# EAGLE design MacroRail (EAGLE 9.5.1)
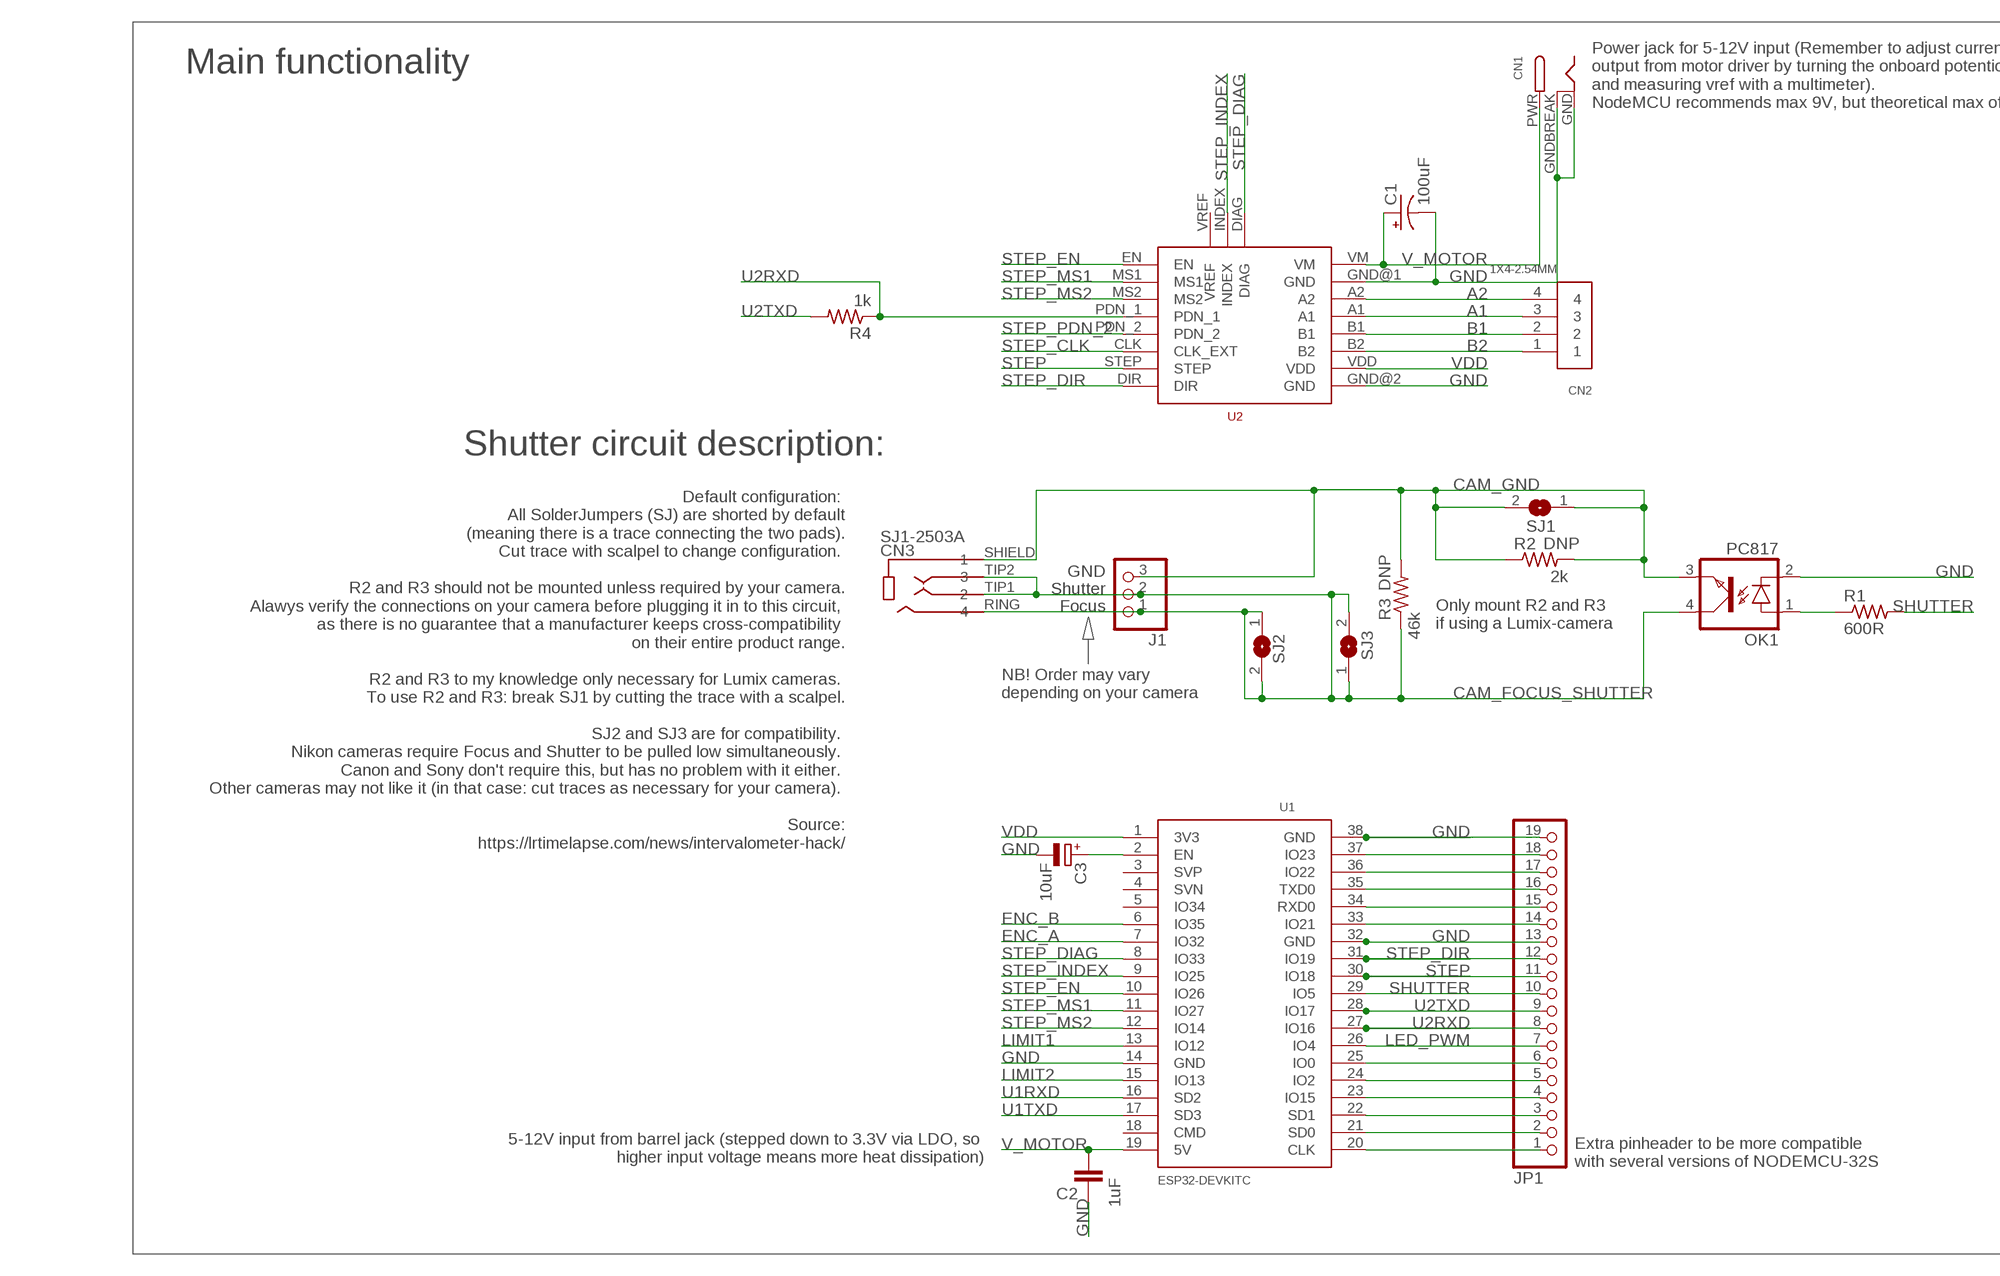
[diagram p0: schematic, sheet 1, part 1 of 2]
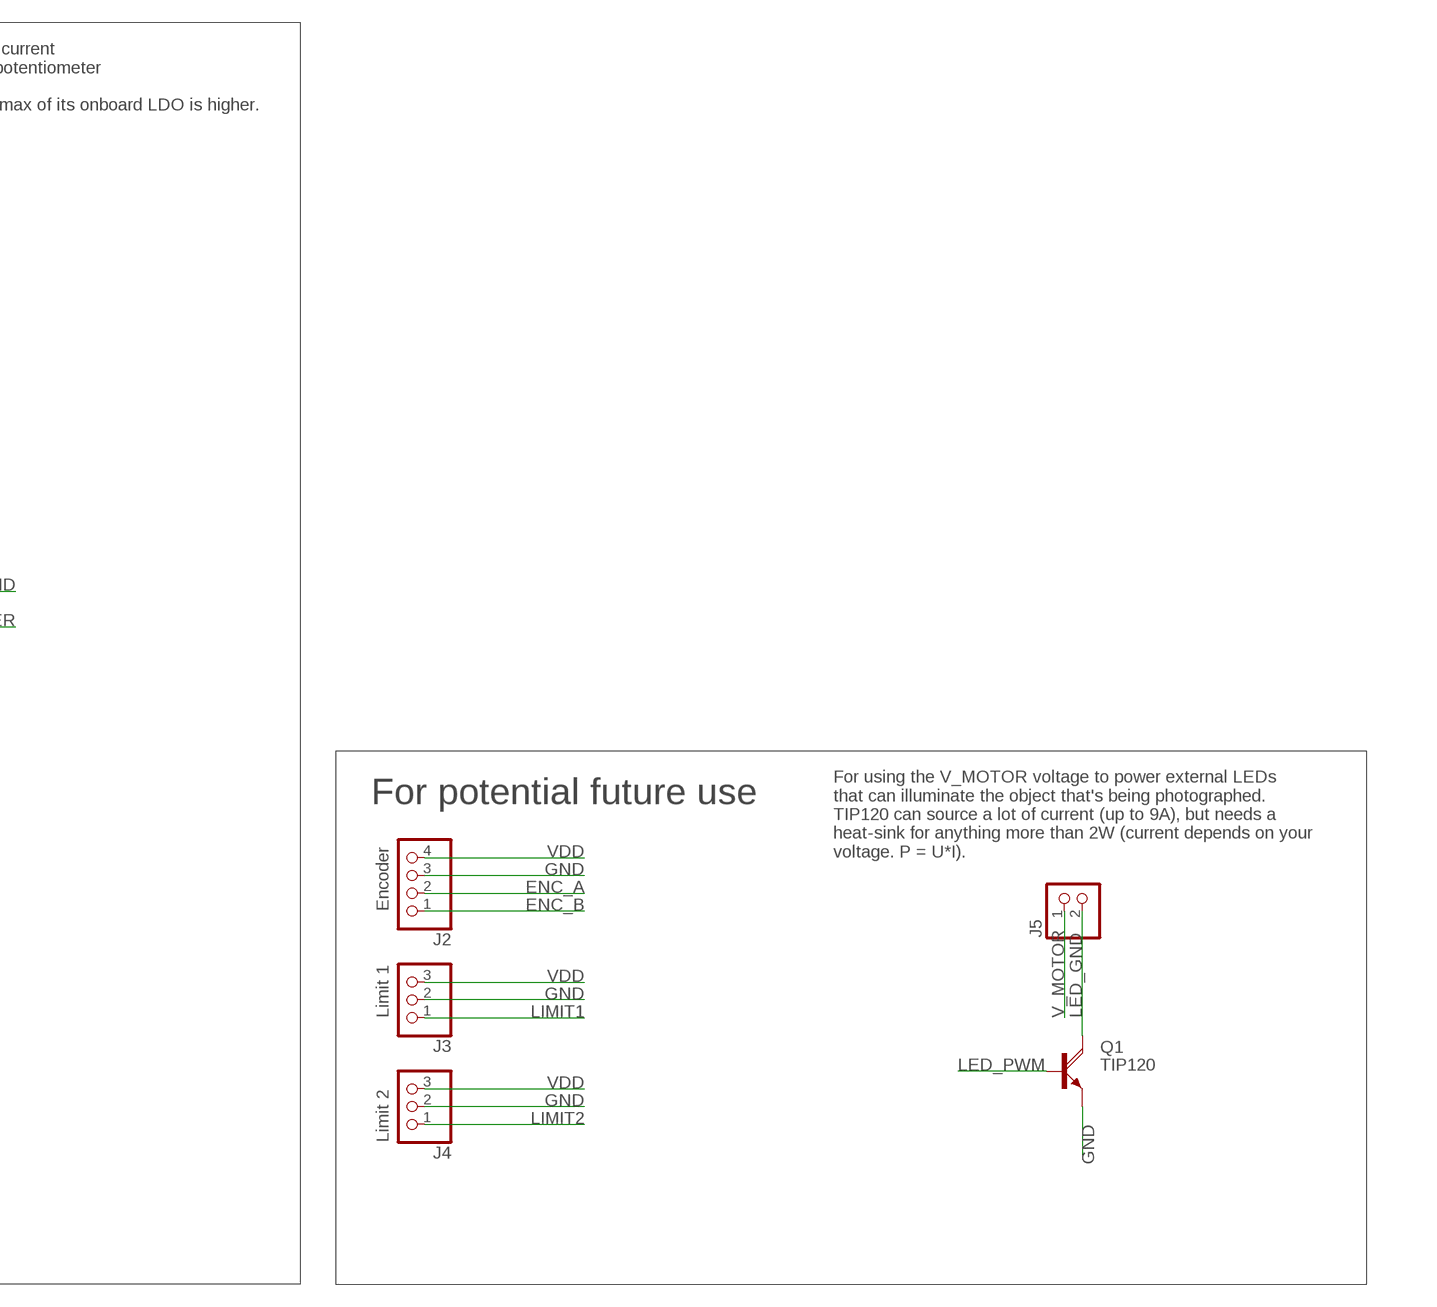
[diagram p1: schematic, sheet 1, part 2 of 2]

## Parts
C1  100uF  CPOL-USE5-8.5  [E5-8,5]
C2  1uF  C-EU050-024X044  [C050-024X044]
C3  10uF  CPOL-EUE1.8-4  [E1,8-4]
CN1  DCBARRELPTH  [DCJACK_2MM_PTH]
CN2  1X4-2.54MM  [1X04-2.54MM]
CN3  SJ1-2503A  [STEREOJACK2.5MM_STEREOJACK2.5MM]
J1  PINHD-1X3CB  [1X03-CLEANBIG]
J2  PINHD-1X4  [1X04]
J3  PINHD-1X3CB  [1X03-CLEANBIG]
J4  PINHD-1X3CB  [1X03-CLEANBIG]
J5  PINHD-1X2CLEAN  [1X02CLEAN]
JP1  PINHD-1X19  [1X19]
OK1  PC817  [DIL04]
Q1  TIP120  [TO220AH]
R1  600R  R-US_0207/7  [0207/7]
R2  2k  R-US_0207/7  [0207/7]
R3  46k  R-US_0207/7  [0207/7]
R4  1k  R-US_0207/7  [0207/7]
SJ1  SJ  [SJ]
SJ2  SJ  [SJ]
SJ3  SJ  [SJ]
U1  ESP32DEVKITCWIDE  [NODEMCU-32S]
U2  TMC2209-V1.2+INDEX  [BIGTREETECH-TMC2209-V1.2+INDEX]

## Nets
A1 [PWR]: CN2.3 U2.A1
A2 [PWR]: CN2.4 U2.A2
B1 [PWR]: CN2.2 U2.B1
B2 [PWR]: CN2.1 U2.B2
CAM_FOCUS_SHUTTER: CN3.RING CN3.TIP1 CN3.TIP2 J1.1 J1.2 OK1.4(COL) R3.1 SJ2.1 SJ2.2 SJ3.1 SJ3.2
CAM_GND: CN3.SHIELD J1.3 OK1.3(EMIT) R2.1 R2.2 R3.2 SJ1.1 SJ1.2
ENC_A: J2.2 U1.7(IO32)
ENC_B: J2.1 U1.6(IO35)
GND [PWR]: C1.- C2.1 C3.- CN1.GND CN1.GNDBREAK J2.3 J3.2 J4.2 JP1.13 JP1.19 OK1.2(C) Q1.E U1.14(GND) U1.32(GND) U1.38(GND) U2.GND@1(GND) U2.GND@2(GND)
LED_GND: J5.2 Q1.C
LED_PWM: JP1.7 Q1.B U1.26(IO4)
LIMIT1: J3.1 U1.13(IO12)
LIMIT2: J4.1 U1.15(IO13)
N$1: OK1.1(A) R1.1
N$2: C3.+ U1.2(EN)
N$3: JP1.18 U1.37(IO23)
N$4: JP1.17 U1.36(IO22)
N$5: JP1.16 U1.35(TXD0)
N$6: JP1.15 U1.34(RXD0)
N$7: JP1.14 U1.33(IO21)
N$10: JP1.6 U1.25(IO0)
N$11: JP1.5 U1.24(IO2)
N$12: JP1.4 U1.23(IO15)
N$13: JP1.3 U1.22(SD1)
N$14: JP1.2 U1.21(SD0)
N$15: JP1.1 U1.20(CLK)
SHUTTER: JP1.10 R1.2 U1.29(IO5)
STEP: JP1.11 U1.30(IO18) U2.STEP
STEP_CLK [PWR]: U2.CLK(CLK_EXT)
STEP_DIAG: U1.8(IO33) U2.DIAG
STEP_DIR: JP1.12 U1.31(IO19) U2.DIR
STEP_EN: U1.10(IO26) U2.EN
STEP_INDEX: U1.9(IO25) U2.INDEX
STEP_MS1: U1.11(IO27) U2.MS1
STEP_MS2: U1.12(IO14) U2.MS2
STEP_PDN_2: U2.PDN_2
U1RXD: U1.16(SD2)
U1TXD: U1.17(SD3)
U2RXD: JP1.8 R4.1 U1.27(IO16) U2.PDN_1
U2TXD: JP1.9 R4.2 U1.28(IO17)
V_MOTOR [PWR]: C1.+ C2.2 CN1.PWR J5.1 U1.19(5V) U2.VM
VDD [PWR]: J2.4 J3.3 J4.3 U1.1(3V3) U2.VDD
Unconnected: U1.3(SVP) U1.4(SVN) U1.5(IO34) U1.18(CMD) U2.VREF

## Notes on the sheet
- Main functionality
- Power jack for 5-12V input (Remember to adjust current 
  output from motor driver by turning the onboard potentiometer
  and measuring vref with a multimeter).
  NodeMCU recommends max 9V, but theoretical max of its onboard LDO is higher.
- Shutter circuit description:
- Default configuration: 
  All SolderJumpers (SJ) are shorted by default
  (meaning there is a trace connecting the two pads).
  Cut trace with scalpel to change configuration. 
  
  R2 and R3 should not be mounted unless required by your camera.
  Alawys verify the connections on your camera before plugging it in to this circuit, 
  as there is no guarantee that a manufacturer keeps cross-compatibility 
  on their entire product range.
  
  R2 and R3 to my knowledge only necessary for Lumix cameras. 
  To use R2 and R3: break SJ1 by cutting the trace with a scalpel.
  
  SJ2 and SJ3 are for compatibility. 
  Nikon cameras require Focus and Shutter to be pulled low simultaneously. 
  Canon and Sony don't require this, but has no problem with it either. 
  Other cameras may not like it (in that case: cut traces as necessary for your camera). 
  
  Source:
  https://lrtimelapse.com/news/intervalometer-hack/
- GND
- Shutter
- Focus
- Only mount R2 and R3 
  if using a Lumix-camera
- NB! Order may vary 
  depending on your camera
- For potential future use
- For using the V_MOTOR voltage to power external LEDs 
  that can illuminate the object that's being photographed.
  TIP120 can source a lot of current (up to 9A), but needs a 
  heat-sink for anything more than 2W (current depends on your
  voltage. P = U*I).
- Encoder
- Limit 1
- Limit 2
- 5-12V input from barrel jack (stepped down to 3.3V via LDO, so 
  higher input voltage means more heat dissipation)
- Extra pinheader to be more compatible 
  with several versions of NODEMCU-32S

## Library data of the parts
C1 = rcl:CPOL-US: POLARIZED CAPACITOR, American symbol; SPICEPREFIX: C
C2 = rcl:C-EU: CAPACITOR, European symbol; SPICEPREFIX: C
C3 = rcl:CPOL-EU: POLARIZED CAPACITOR, European symbol; SPICEPREFIX: C
CN1 = 00-Random-Components-Simen:DCBARREL: 2.0mm DC Barrel Jack DCJACK_2MM_PTH - Through Hole Jack (4UConnector: 05537)
CN2 = 00-Random-Components-Simen:1X4: 4-pin connector
CN3 = 00-Random-Components-Simen:SJ1-2503A: Stereo jack 2.5mm Mouser:https://no.mouser.com/ProductDetail/CUI-Devices/SJ1-2503A?qs=WyjlAZoYn52728cbIH3aBA%3D%3D Mechanical drawing: https://no.mouser.com/datasheet/2/670/sj1_2503a-1779217.pdf AliExpress: https://s.click.aliexpress.com/e/_AMfutT
J1 J3 J4 = adafruit:PINHD-1X3: PIN HEADER
J2 = pinhead-custom:PINHD-1X4: PIN HEADER
J5 = pinhead-custom:PINHD-1X2: PIN HEADER
JP1 = pinhead-custom:PINHD-1X19: PIN HEADER
OK1 = 00-Random-Components-Simen:PC817: SHARP OPTO COUPLER; MPN: PC817X4J000F; OC_FARNELL: 9707727; OC_NEWARK: 97K7059
Q1 = 00-Random-Components-Simen:TIP120: NPN DARLINGTON TRANSISTOR
R1 R4 = rcl:R-US_: RESISTOR, American symbol; SPICEPREFIX: R
R2 R3 = rcl:R-US_: RESISTOR, American symbol; DNP: 1; SPICEPREFIX: R
SJ1-SJ3 = jumper:SJ: SMD solder JUMPER
U1 = ESP32-DEVKITC:ESP32DEVKITC: Documentation: https://docs.ai-thinker.com/en/esp32/boards/nodemcu_32s
U2 = 00-Random-Components-Simen:TMC2209-V1.2+INDEX: Manual: https://github.com/bigtreetech/BIGTREETECH-TMC2209-V1.2/blob/master/manual/TMC2209-V1.2-manual.pdf https://www.aliexpress.com/item/1005002625638207.html

## Net classes
1 PWR: width 1.27 mm

## Board
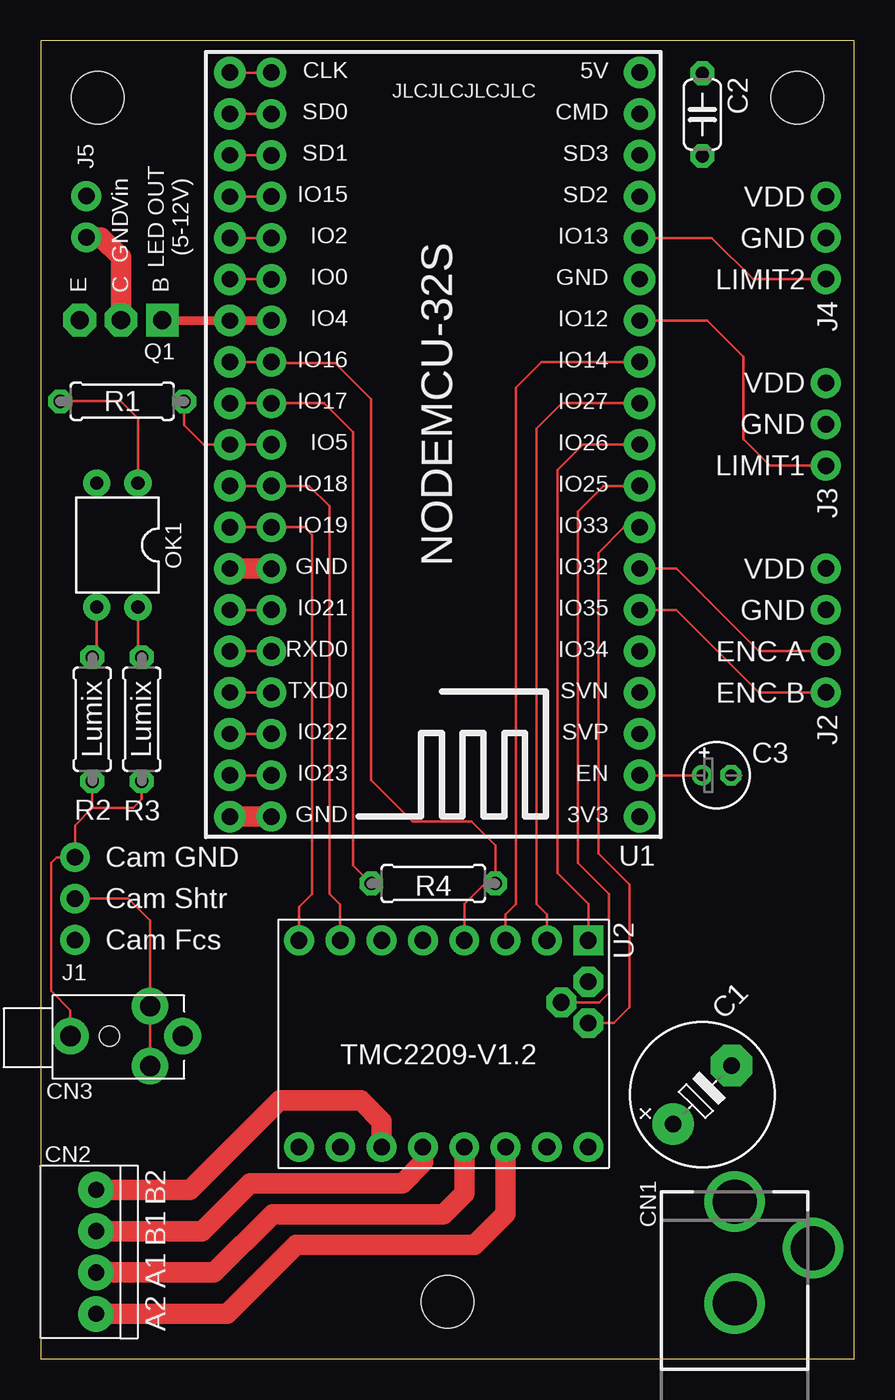
[diagram p2: board, top side]
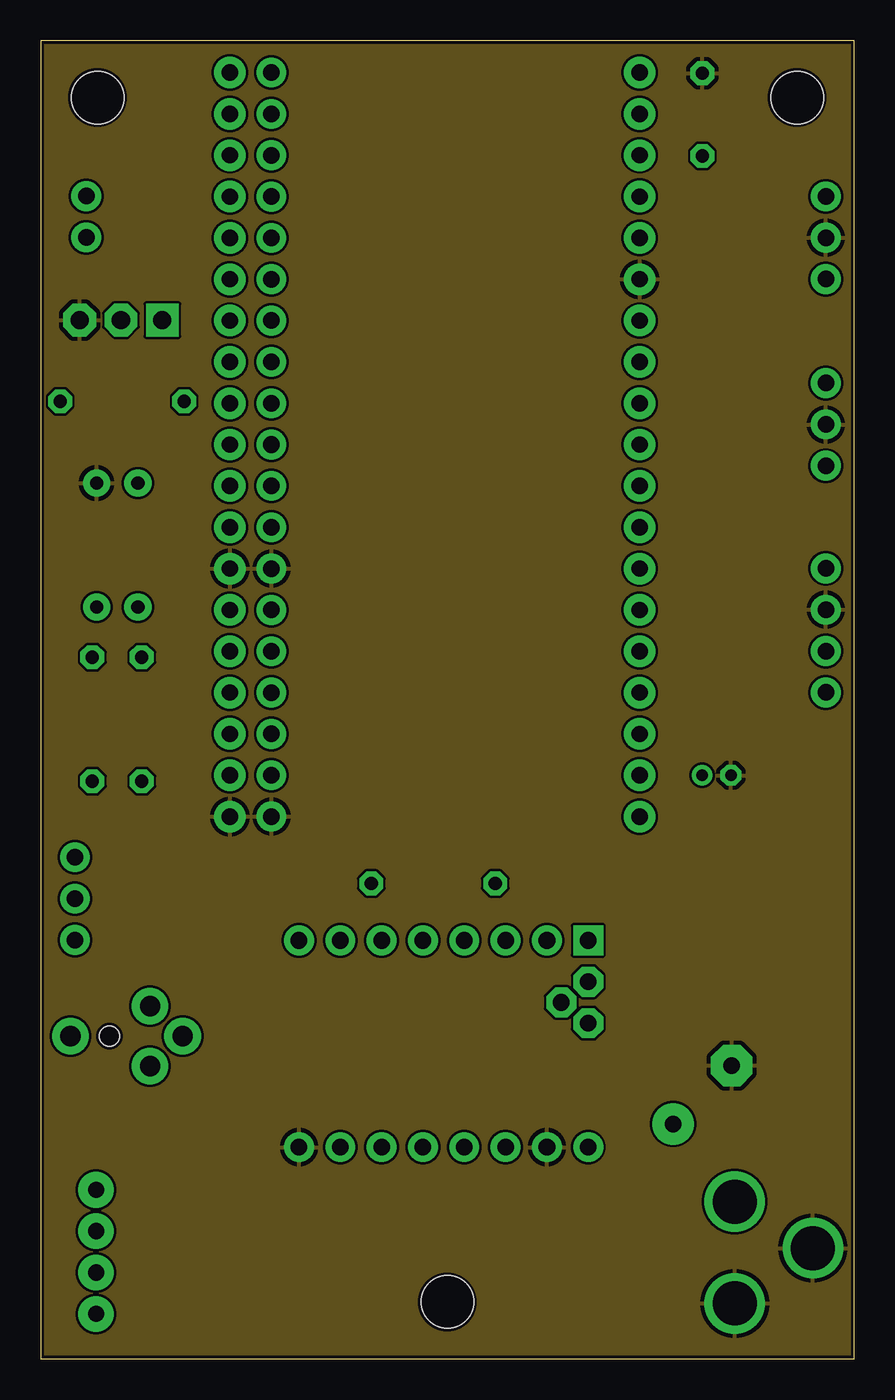
[diagram p3: board, inner layer Route2]
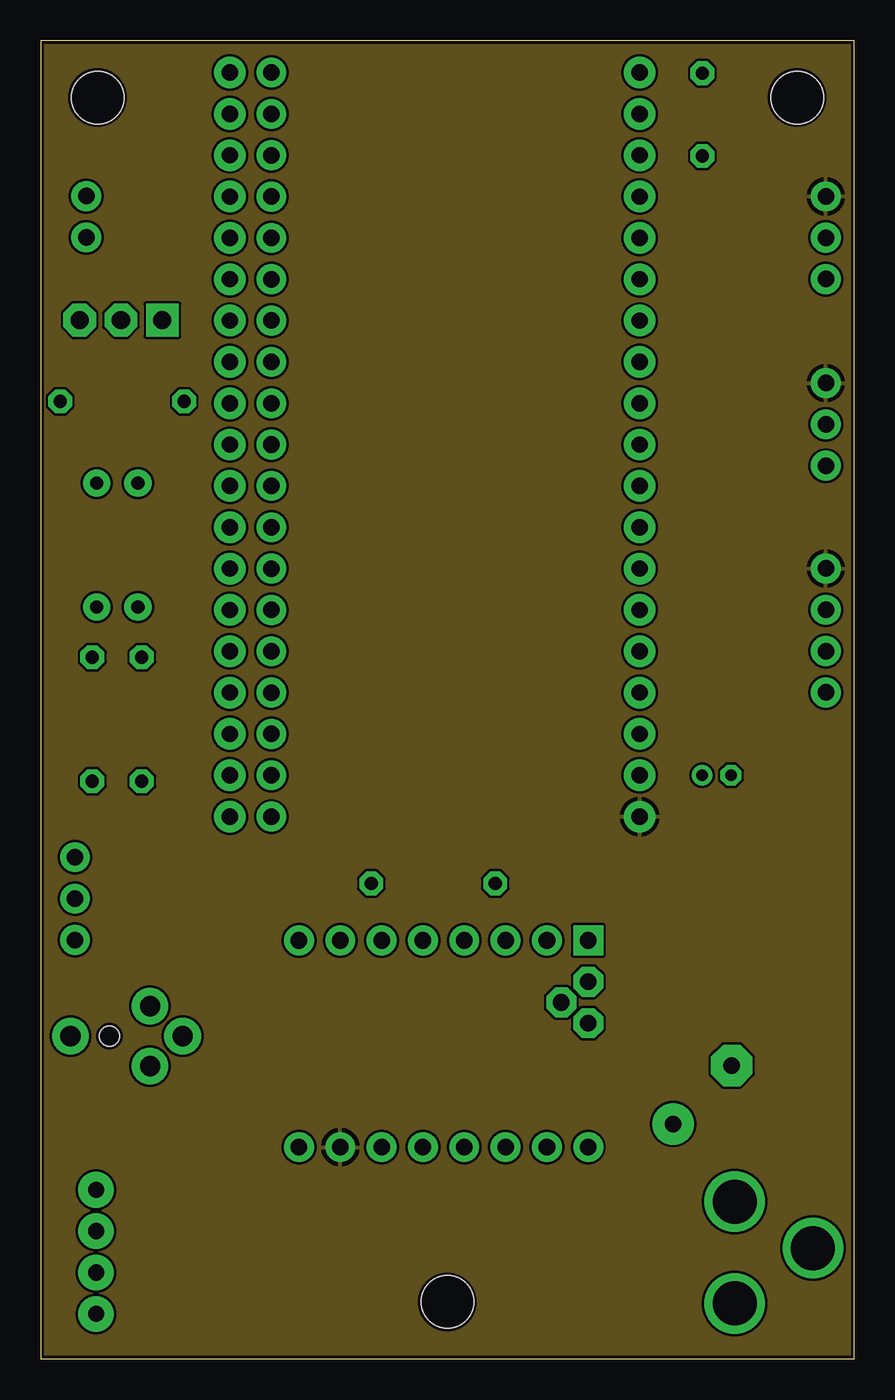
[diagram p4: board, inner layer Route15]
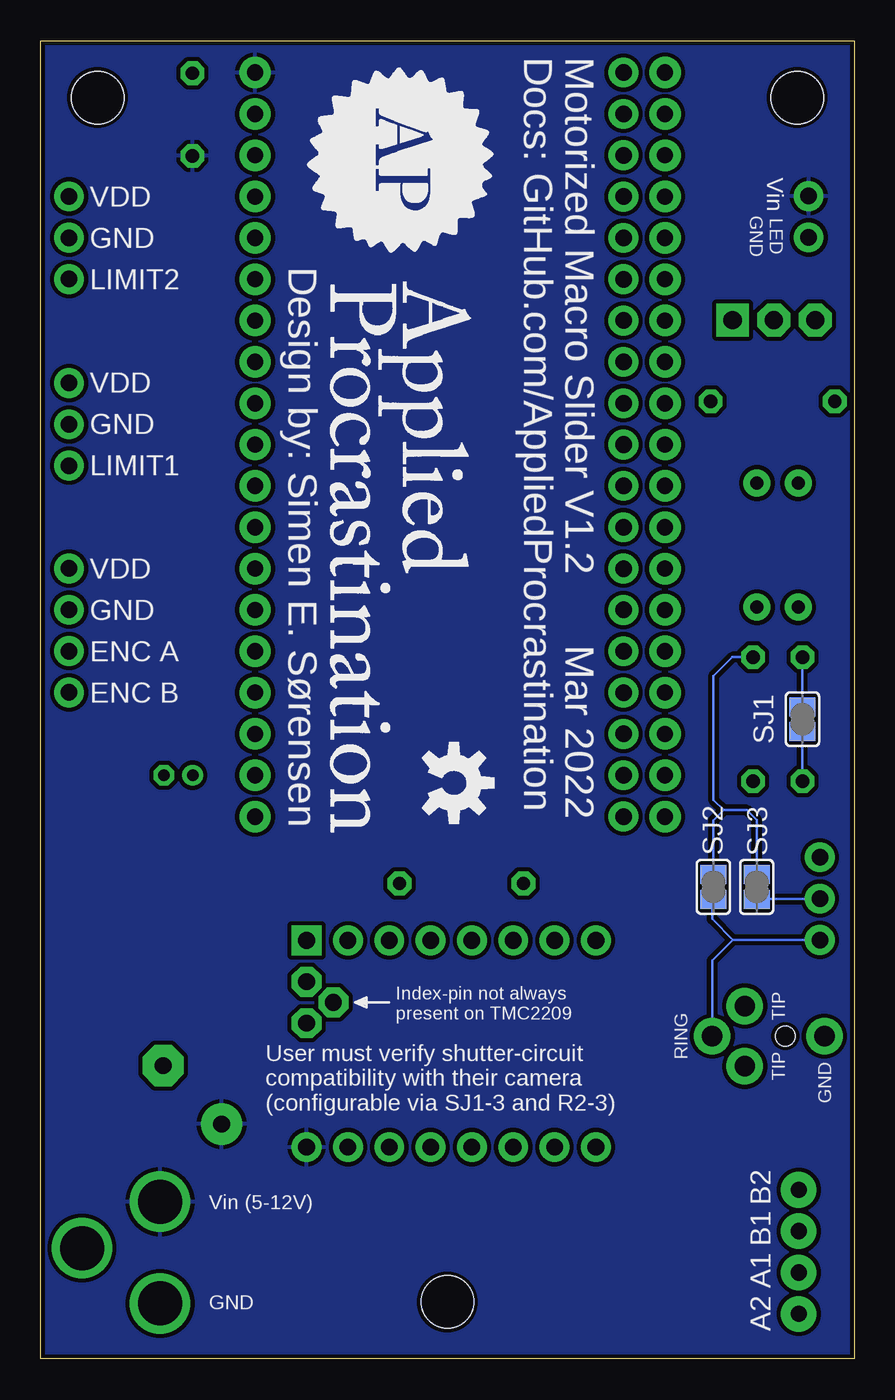
[diagram p5: board, bottom side, seen from below]

Size 50 x 81 mm. Coordinates in mm from the lower left corner, seen from the top.
Outline: 0,0 50,0 50,81 0,81 0,0
Copper layers (1*16): Top 0.035mm / dielectric 1.5mm / Bottom 0.035mm
Design rules "default *": minimum track width 6mil, minimum drill 0.35mm, track to track 6mil, track to pad 6mil, pad to pad 6mil, via to via 6mil, smd to smd 6mil, copper to edge 0.2mm, drill to drill 6mil, minimum pad ring 10mil, minimum via ring 8mil, stop-mask expansion 4mil, vias tented up to drill 0mil, thermal gap 10mil
Holes 3.2 mm at 46.5,77.5 3.5,77.5 25,3.5

### Footprints (pad centres in the part's own frame; a part is rotated, then mirrored left to right if it is on the bottom)
E5-8,5 = drill 1.016 pad 2.54: + -2.54,0 | drill 1.016 pad 2.54 octagon: - 2.54,0
C050-024X044 = drill 0.813 octagon: 1 -2.54,0; 2 2.54,0
E1,8-4 = drill 0.711 pad 1.168: + -0.889,0 | drill 0.711 pad 1.168 octagon: - 0.889,0
DCJACK_2MM_PTH = drill 2.7: GND 0,7.35; GNDBREAK 4.8,10.75; PWR 0,13.6
1X04-2.54MM = drill 1 pad 2.184: 1 -3.81,0; 2 -1.27,0; 3 1.27,0; 4 3.81,0
STEREOJACK2.5MM_STEREOJACK2.5MM = drill 1.25: RING 4.5,0; SHIELD -2.4,0; TIP1 2.5,-1.85; TIP2 2.5,1.85 | hole 1.2: 0,0
1X03-CLEANBIG = drill 1.016 pad 1.676: 1 -2.54,0; 2 0,0; 3 2.54,0
1X04 = drill 1.016: 1 -3.81,0; 2 -1.27,0; 3 1.27,0; 4 3.81,0
1X02CLEAN = drill 1.016: 1 -1.27,0; 2 1.27,0
1X19 = drill 1.016: 1 -22.86,0; 2 -20.32,0; 3 -17.78,0; 4 -15.24,0; 5 -12.7,0; 6 -10.16,0; 7 -7.62,0; 8 -5.08,0; 9 -2.54,0; 10 0,0; 11 2.54,0; 12 5.08,0; 13 7.62,0; 14 10.16,0; 15 12.7,0; 16 15.24,0; 17 17.78,0; 18 20.32,0; 19 22.86,0
DIL04 = drill 0.813 pad 1.676: 1 -1.27,-3.81; 2 1.27,-3.81; 3 1.27,3.81; 4 -1.27,3.81
TO220AH = drill 1.118 pad 1.778 square: B 0,0 | drill 1.118 pad 1.778 octagon: C 2.54,0; E 5.08,0
0207/7 = drill 0.813 octagon: 1 -3.81,0; 2 3.81,0
SJ = smd 1.168 x 1.6: 1 -0.762,0; 2 0.762,0
NODEMCU-32S = drill 1 pad 1.93: 1 -22.87,-11.42; 2 -20.33,-11.42; 3 -17.79,-11.42; 4 -15.25,-11.42; 5 -12.71,-11.42; 6 -10.17,-11.42; 7 -7.63,-11.42; 8 -5.09,-11.42; 9 -2.55,-11.42; 10 -0.01,-11.42; 11 2.53,-11.42; 12 5.07,-11.42; 13 7.61,-11.42; 14 10.15,-11.42; 15 12.69,-11.42; 16 15.23,-11.42; 17 17.77,-11.42; 18 20.31,-11.42; 19 22.85,-11.42; 20 22.85,13.77; 21 20.31,13.77; 22 17.77,13.77; 23 15.23,13.77; 24 12.69,13.77; 25 10.15,13.77; 26 7.61,13.77; 27 5.07,13.77; 28 2.53,13.77; 29 -0.01,13.77; 30 -2.55,13.77; 31 -5.09,13.77; 32 -7.63,13.77; 33 -10.17,13.77; 34 -12.71,13.77; 35 -15.25,13.77; 36 -17.79,13.77; 37 -20.33,13.77; 38 -22.87,13.77
BIGTREETECH-TMC2209-V1.2+INDEX = drill 1.02: A1 12.7,-7.62; A2 12.7,-5.08; B1 12.7,-10.16; B2 12.7,-12.7; CLK 0,-12.7; DIR 0,-17.78; GND@1 12.7,-17.78; GND@2 12.7,-2.54; MS1 0,-2.54; MS2 0,-5.08; PDN_1 0,-7.62; PDN_2 0,-10.16; STEP 0,-15.24; VDD 12.7,-15.24; VM 12.7,0 | drill 1.02 octagon: DIAG 5.08,0; INDEX 3.81,-1.651; VREF 2.54,0 | drill 1.02 square: EN 0,0

### Placement (x,y rotation side)
C1  40.67,16.23 45 top
C2  40.67,76.46 270 top
C3  41.54,35.86 0 top
CN1  42.66,-3.95 0 top
CN2  3.41,6.58 270 top
CN3  4.22,19.83 0 top
J1  2.11,28.28 90 top
J2  48.26,44.76 90 top
J3  48.26,57.42 90 top
J4  48.26,68.89 90 top
J5  2.8,70.18 270 top
JP1  14.18,56.18 270 top
OK1  4.71,50.01 180 top
Q1  7.47,63.83 180 top
R1  5.01,58.84 0 top
R2  3.17,39.3 270 top
R3  6.21,39.3 270 top
R4  24.13,29.21 180 top
SJ1  3.17,39.3 90 bottom
SJ2  8.65,29 270 bottom
SJ3  6,29 90 bottom
U1  25.4,56.19 90 top
U2  33.66,25.71 270 top
U$2  [APPLIED-PROCRASTINATION-FULL]  27.94,73.66 270 bottom
U$3  [OSHW-LOGO-M]  24.6,35.39 270 bottom

### Tracks (layer width: path | path; a pad name or v marks a point on that pad's centre or on a via)
A1
  Top 1.27: U2.A1 26.04,10.16 24.77,8.89 14.25,8.89 10.66,5.3 CN2.3
A2
  Top 1.27: U2.A2 28.57,8.9 26.67,7 15.7,7 11.46,2.77 CN2.4
B1
  Top 1.27: U2.B1 23.5,12.06 22.23,10.79 12.88,10.79 9.93,7.84 CN2.2
B2
  Top 1.27: U2.B2 20.95,14.61 19.68,15.88 14.67,15.88 9.18,10.38 CN2.1
CAM_FOCUS_SHUTTER
  Top 0.152: CN3.TIP1 CN3.TIP2 6.72,26.93 5.38,28.28 J1.2 | R3.1 5.98,43.35 OK1.4
  Bottom 0.152: J1.2 5.96,28.27 SJ3.1 SJ3.2 6,33.11 6.61,33.72 8.02,33.72 | J1.1 2.13,25.76 7.45,25.76 | R3.1 7.49,43.12 8.65,41.95 8.65,34.35 8.02,33.72 | 8.02,33.72 8.65,33.09 SJ2.1 SJ2.2 8.65,28.04 8.72,27.97 8.72,27.03 7.45,25.76 | CN3.RING 8.72,24.48 7.45,25.76
CAM_GND
  Top 0.152: R2.2 3.17,33.84 | 3.17,33.84 2.11,32.78 J1.3 0.97,30.82 0.64,30.48 0.64,22.61 1.82,21.43 CN3.SHIELD | OK1.3 3.44,43.38 R2.1 | 3.17,33.84 5.67,33.84 6.21,34.39 R3.2
  Bottom 0.152: R2.2 SJ1.1 SJ1.2 R2.1
ENC_A
  Top 0.152: J2.2 44.14,43.49 39.07,48.56 U1.7
ENC_B
  Top 0.152: U1.6 39.07,46.02 44.14,40.95 J2.1
GND
  Top 1.27: JP1.13 U1.32 | U1.38 JP1.19
  pour Route2: 0,0 50,0 50,81 0,81
LED_GND
  Top 1.27: J5.2 3.73,68.91 4.93,67.7 Q1.C
LED_PWM
  Top 0.508: Q1.B 7.5,63.8 U1.26 JP1.7
LIMIT1
  Top 0.152: J3.1 44.81,54.88 43.18,56.52 43.18,61.59 40.98,63.8 U1.13
LIMIT2
  Top 0.152: J4.1 43.8,66.34 41.27,68.88 U1.15
N$1
  Top 0.152: OK1.1 5.98,57.78 4.92,58.84 R1.1
N$2
  Top 0.152: U1.2 C3.+
N$3
  Top 0.152: U1.37 JP1.18
N$4
  Top 0.152: JP1.17 U1.36
N$5
  Top 0.152: U1.35 JP1.16
N$6
  Top 0.152: JP1.15 U1.34
N$7
  Top 0.152: U1.33 JP1.14
N$10
  Top 0.152: U1.25 JP1.6
N$11
  Top 0.152: JP1.5 U1.24
N$12
  Top 0.152: U1.23 JP1.4
N$13
  Top 0.152: JP1.3 U1.22
N$14
  Top 0.152: U1.21 JP1.2
N$15
  Top 0.152: JP1.1 U1.20
SHUTTER
  Top 0.152: JP1.10 U1.29 10.02,56.18 8.82,57.38 R1.2
STEP
  Top 0.152: U2.STEP 18.41,27.91 17.75,28.57 17.75,52.4 16.51,53.64 JP1.11 U1.30
STEP_DIAG
  Top 0.152: U2.DIAG 35.23,20.63 36.2,21.59 36.2,29.16 34.29,31.06 34.29,49.53 35.86,51.1 U1.8
STEP_DIR
  Top 0.152: U2.DIR 15.88,27.77 16.68,28.57 16.68,50.63 16.21,51.1 JP1.12 U1.31
STEP_EN
  Top 0.152: U2.EN 33.66,27.94 31.75,29.84 31.75,54.61 33.32,56.18 U1.10
STEP_INDEX
  Top 0.152: U2.INDEX 34.34,21.9 34.92,22.48 34.92,28.57 33.02,30.48 33.02,52.07 34.59,53.64 U1.9
STEP_MS1
  Top 0.152: U1.11 32.05,58.72 30.48,57.15 30.48,27.94 31.11,27.3 U2.MS1
STEP_MS2
  Top 0.152: U1.12 30.78,61.26 29.21,59.69 29.21,27.94 28.57,27.3 U2.MS2
U2RXD
  Top 0.152: U2.PDN_1 26.04,27.94 27.3,29.21 R4.1 27.94,31.56 26.48,33.02 22.86,33.02 20.32,35.56 20.32,58.98 18.1,61.2 14.24,61.2 JP1.8 U1.27
U2TXD
  Top 0.152: U1.28 JP1.9 17.42,58.72 19.2,56.94 19.2,30.33 R4.2
V_MOTOR
  pour Bottom (isolate 0.254): 0,0 50,0 50,81 0,81
VDD
  pour Route15: 0,0 50,0 50,81 0,81

### Text on the board
tPlace: Vin | LED OUT / (5-12V) | GND | E | C | B
bPlace: Vin | LED / GND
tNames: JLCJLCJLCJLC | VDD | GND | LIMIT2 | VDD | GND | LIMIT1 | VDD | GND | ENC A | ENC B | Lumix | Lumix | Cam GND | Cam Shtr | Cam Fcs | TMC2209-V1.2 | B2 | B1 | A1 | A2
bNames: Motorized Macro Slider V1.2 | Docs: GitHub.com/AppliedProcrastination | VDD | GND | LIMIT2 | VDD | GND | LIMIT1 | VDD | GND | ENC A | ENC B | Mar 2022 | Design by: Simen E. Sørensen | TIP | Index-pin not always / present on TMC2209 | RING | GND | TIP | User must verify shutter-circuit / compatibility with their camera / (configurable via SJ1-3 and R2-3) | B2 | Vin (5-12V) | B1 | A1 | A2 | GND